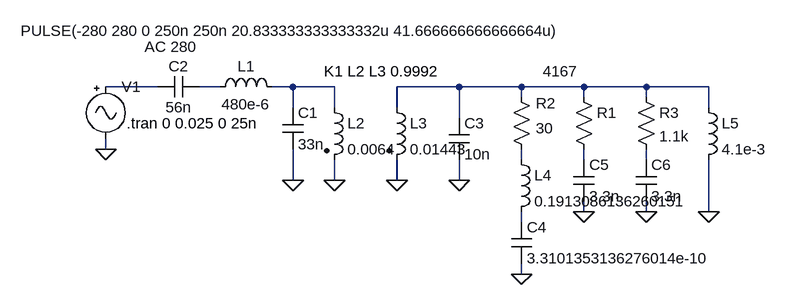
[diagram p0: schematic WaveUltrasonicOutputStage.asc]
WaveUltrasonicOutputStage.asc, the LTspice schematic file:
Version 4
SHEET 1 1168 420
WIRE 144 112 64 112
WIRE 240 112 208 112
WIRE 352 112 320 112
WIRE 416 112 352 112
WIRE 608 112 512 112
WIRE 704 112 608 112
WIRE 800 112 704 112
WIRE 896 112 800 112
WIRE 992 112 896 112
WIRE 704 128 704 112
WIRE 800 128 800 112
WIRE 896 128 896 112
WIRE 352 144 352 112
WIRE 416 144 416 112
WIRE 512 144 512 112
WIRE 992 144 992 112
WIRE 608 160 608 112
WIRE 64 208 64 192
WIRE 704 224 704 208
WIRE 800 224 800 208
WIRE 896 224 896 208
WIRE 352 256 352 208
WIRE 416 256 416 224
WIRE 512 256 512 224
WIRE 608 256 608 224
WIRE 800 304 800 288
WIRE 896 304 896 288
WIRE 992 304 992 224
WIRE 704 320 704 304
WIRE 704 400 704 384
FLAG 64 208 0
FLAG 416 256 0
FLAG 512 256 0
FLAG 608 256 0
FLAG 704 400 0
FLAG 352 256 0
FLAG 800 304 0
FLAG 896 304 0
FLAG 992 304 0
SYMBOL Misc\\signal 64 96 R0
WINDOW 123 60 -46 Left 2
WINDOW 39 0 0 Left 0
WINDOW 3 -131 -70 Left 2
SYMATTR Value2 AC 280
SYMATTR Value PULSE(-280 280 0 250n 250n 20.833333333333332u 41.666666666666664u)
SYMATTR InstName V1
SYMBOL ind2 400 128 R0
SYMATTR InstName L2
SYMATTR Value 0.0064
SYMATTR Type ind
SYMBOL ind2 496 128 R0
SYMATTR InstName L3
SYMATTR Value 0.01443
SYMATTR Type ind
SYMBOL ind 688 208 R0
SYMATTR InstName L4
SYMATTR Value 0.1913086136260151
SYMBOL cap 688 320 R0
SYMATTR InstName C4
SYMATTR Value 3.3101353136276014e-10
SYMBOL res 688 112 R0
WINDOW 3 38 64 Left 2
WINDOW 0 38 25 Left 2
SYMATTR Value 30
SYMATTR InstName R2
SYMBOL ind 224 128 R270
WINDOW 0 32 56 VTop 2
WINDOW 3 5 56 VBottom 2
SYMATTR InstName L1
SYMATTR Value 480e-6
SYMBOL cap 336 144 R0
SYMATTR InstName C1
SYMATTR Value 33n
SYMBOL cap 208 96 R90
WINDOW 0 0 32 VBottom 2
WINDOW 3 32 32 VTop 2
SYMATTR InstName C2
SYMATTR Value 56n
SYMBOL res 784 112 R0
WINDOW 3 -47 -24 Left 2
SYMATTR Value 4167
SYMATTR InstName R1
SYMBOL cap 784 224 R0
SYMATTR InstName C5
SYMATTR Value 3.3n
SYMBOL res 880 112 R0
SYMATTR InstName R3
SYMATTR Value 1.1k
SYMBOL cap 880 224 R0
SYMATTR InstName C6
SYMATTR Value 3.3n
SYMBOL cap 592 160 R0
SYMATTR InstName C3
SYMATTR Value 10n
SYMBOL ind 976 128 R0
SYMATTR InstName L5
SYMATTR Value 4.1e-3
TEXT 96 168 Left 2 !.tran 0 0.025 0 25n
TEXT 400 88 Left 2 !K1 L2 L3 0.9992

The netlist it stands for:
* WaveUltrasonicOutputStage.asc
V1 N001 0 PULSE(-280 280 0 250n 250n 20.833333333333332u 41.666666666666664u) AC 280
L2 N003 0 0.0064
L3 N004 0 0.01443
L4 N005 N008 0.1913086136260151
C4 N008 0 3.3101353136276014e-10
R2 N004 N005 30
L1 N002 N003 480e-6
C1 N003 0 33n
C2 N002 N001 56n
R1 N004 N006 4167
C5 N006 0 3.3n
R3 N004 N007 1.1k
C6 N007 0 3.3n
C3 N004 0 10n
L5 N004 0 4.1e-3
.tran 0 0.025 0 25n
K1 L2 L3 0.9992
.backanno
.end